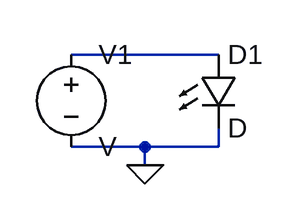
[diagram p0: schematic p4 LED.asc]
p4 LED.asc, the LTspice schematic file:
Version 4
SHEET 1 880 680
WIRE 128 112 0 112
WIRE 64 192 0 192
WIRE 128 192 128 176
WIRE 128 192 64 192
WIRE 64 208 64 192
FLAG 64 208 0
SYMBOL voltage 0 96 R0
SYMATTR InstName V1
SYMBOL LED 112 112 R0
SYMATTR InstName D1

The netlist it stands for:
* p4 LED.asc
V1 N001 0 V
D1 N001 0 D
.model D D
.lib standard.dio
.backanno
.end